# Altium project SpartanMainBoard.PrjPcb
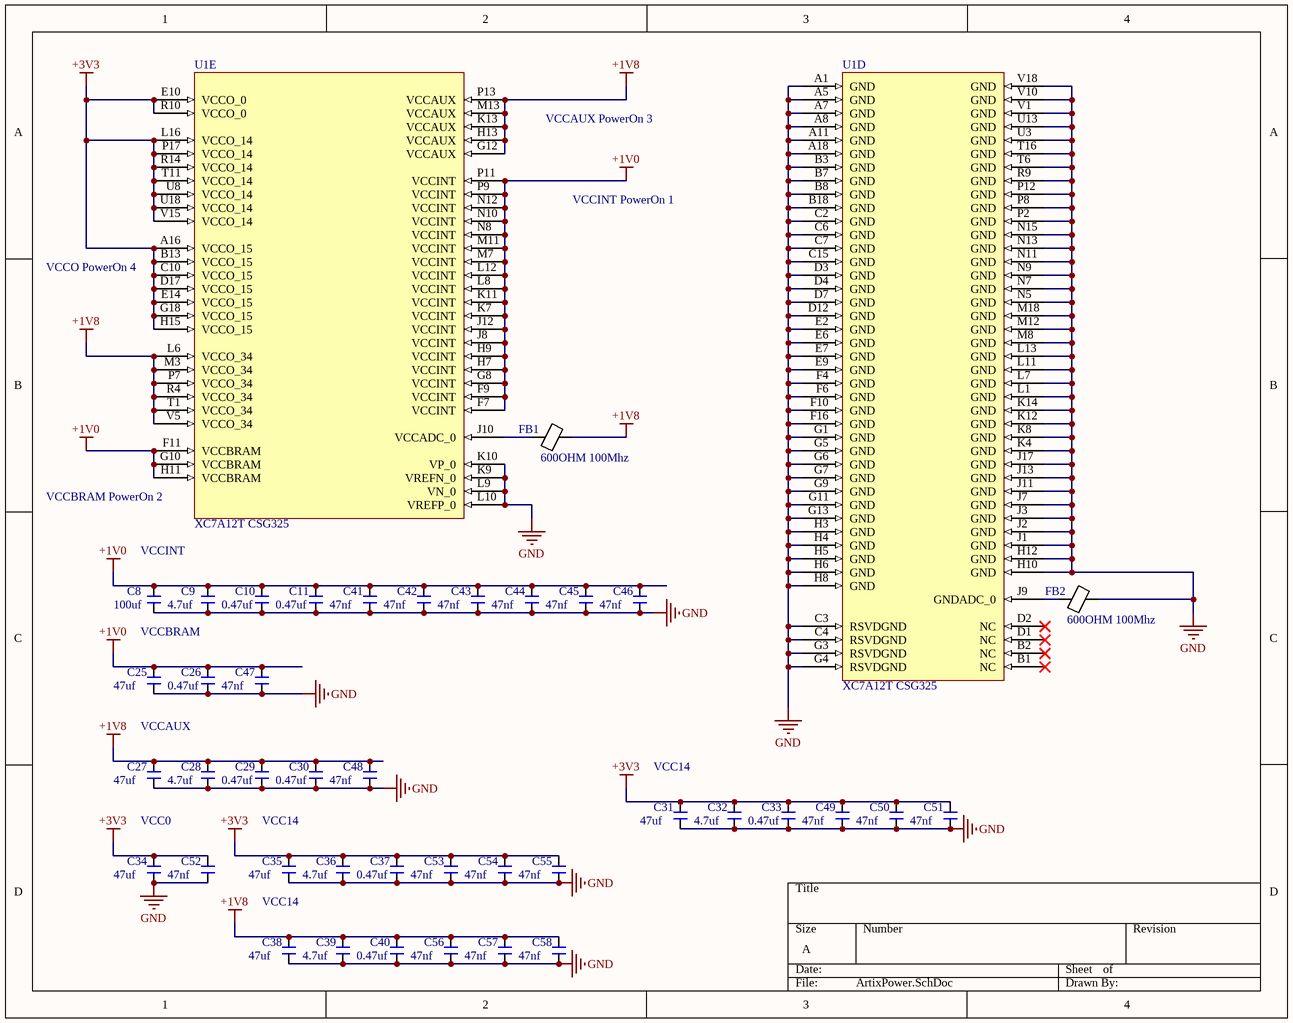
[diagram p0: ArtixPower.SchDoc]
7 sheets, 147 parts. Net scope: global (net labels, ports and power ports of the same name join across sheets).
Board file: PCB1.PcbDoc
Sheets:
  ArtixPower.SchDoc
  ArtixConfig.SchDoc
  ArtixBank14.SchDoc
  ArtixBank15.SchDoc
  ArtixTranscievers.SchDoc
  ArtixBank34.SchDoc
  Power.SchDoc

## Sheet ArtixPower.SchDoc
size A

### Parts
C8  100uf  [1206]
C9  4.7uf  [0402Footprint]
C10  0.47uf  [0402Footprint]
C11  0.47uf  [0402Footprint]
C25  47uf  [0805FOOTPRINT]
C26  0.47uf  [0402Footprint]
C27  47uf  [0805FOOTPRINT]
C28  4.7uf  [0402Footprint]
C29  0.47uf  [0402Footprint]
C30  0.47uf  [0402Footprint]
C31  47uf  [0805FOOTPRINT]
C32  4.7uf  [0402Footprint]
C33  0.47uf  [0402Footprint]
C34  47uf  [0805FOOTPRINT]
C35  47uf  [0805FOOTPRINT]
C36  4.7uf  [0402Footprint]
C37  0.47uf  [0402Footprint]
C38  47uf  [0805FOOTPRINT]
C39  4.7uf  [0402Footprint]
C40  0.47uf  [0402Footprint]
C41  47nf  [0402Footprint]
C42  47nf  [0402Footprint]
C43  47nf  [0402Footprint]
C44  47nf  [0402Footprint]
C45  47nf  [0402Footprint]
C46  47nf  [0402Footprint]
C47  47nf  [0402Footprint]
C48  47nf  [0402Footprint]
C49  47nf  [0402Footprint]
C50  47nf  [0402Footprint]
C51  47nf  [0402Footprint]
C52  47nf  [0402Footprint]
C53  47nf  [0402Footprint]
C54  47nf  [0402Footprint]
C55  47nf  [0402Footprint]
C56  47nf  [0402Footprint]
C57  47nf  [0402Footprint]
C58  47nf  [0402Footprint]
FB1  600OHM 100Mhz  [0805]
FB2  600OHM 100Mhz  [0805]
U1  XC7A12T CSG325  [BGA324C80P18X18_1500X1500X150]  (parts D,E of 7)

### Nets
+1V0: C8.1 C9.1 C10.1 C11.1 C25.1 C26.1 C41.1 C42.1 C43.1 C44.1 C45.1 C46.1 C47.1 U1.F7(VCCINT) U1.F9(VCCINT) U1.F11(VCCBRAM) U1.G8(VCCINT) U1.G10(VCCBRAM) U1.H7(VCCINT) U1.H9(VCCINT) U1.H11(VCCBRAM) U1.J8(VCCINT) U1.J12(VCCINT) U1.K7(VCCINT) U1.K11(VCCINT) U1.L8(VCCINT) U1.L12(VCCINT) U1.M7(VCCINT) U1.M11(VCCINT) U1.N8(VCCINT) U1.N10(VCCINT) U1.N12(VCCINT) U1.P9(VCCINT) U1.P11(VCCINT)
+1V8: C27.1 C28.1 C29.1 C30.1 C38.1 C39.1 C40.1 C48.1 C56.1 C57.1 C58.1 FB1.2 U1.G12(VCCAUX) U1.H13(VCCAUX) U1.K13(VCCAUX) U1.L6(VCCO_34) U1.M3(VCCO_34) U1.M13(VCCAUX) U1.P7(VCCO_34) U1.P13(VCCAUX) U1.R4(VCCO_34) U1.T1(VCCO_34) U1.V5(VCCO_34)
+3V3: C31.1 C32.1 C33.1 C34.1 C35.1 C36.1 C37.1 C49.1 C50.1 C51.1 C52.1 C53.1 C54.1 C55.1 U1.A16(VCCO_15) U1.B13(VCCO_15) U1.C10(VCCO_15) U1.D17(VCCO_15) U1.E10(VCCO_0) U1.E14(VCCO_15) U1.G18(VCCO_15) U1.H15(VCCO_15) U1.L16(VCCO_14) U1.P17(VCCO_14) U1.R10(VCCO_0) U1.R14(VCCO_14) U1.T11(VCCO_14) U1.U8(VCCO_14) U1.U18(VCCO_14) U1.V15(VCCO_14)
GND: C8.2 C9.2 C10.2 C11.2 C25.2 C26.2 C27.2 C28.2 C29.2 C30.2 C31.2 C32.2 C33.2 C34.2 C35.2 C36.2 C37.2 C38.2 C39.2 C40.2 C41.2 C42.2 C43.2 C44.2 C45.2 C46.2 C47.2 C48.2 C49.2 C50.2 C51.2 C52.2 C53.2 C54.2 C55.2 C56.2 C57.2 C58.2 FB2.2 U1.A1(GND) U1.A5(GND) U1.A7(GND) U1.A8(GND) U1.A11(GND) U1.A18(GND) U1.B3(GND) U1.B7(GND) U1.B8(GND) U1.B18(GND) U1.C2(GND) U1.C3(RSVDGND) U1.C4(RSVDGND) U1.C6(GND) U1.C7(GND) U1.C15(GND) U1.D3(GND) U1.D4(GND) U1.D7(GND) U1.D12(GND) U1.E2(GND) U1.E6(GND) U1.E7(GND) U1.E9(GND) U1.F4(GND) U1.F6(GND) U1.F10(GND) U1.F16(GND) U1.G1(GND) U1.G3(RSVDGND) U1.G4(RSVDGND) U1.G5(GND) U1.G6(GND) U1.G7(GND) U1.G9(GND) U1.G11(GND) U1.G13(GND) U1.H3(GND) U1.H4(GND) U1.H5(GND) U1.H6(GND) U1.H8(GND) U1.H10(GND) U1.H12(GND) U1.J1(GND) U1.J2(GND) U1.J3(GND) U1.J7(GND) U1.J11(GND) U1.J13(GND) U1.J17(GND) U1.K4(GND) U1.K8(GND) U1.K9(VREFN_0) U1.K10(VP_0) U1.K12(GND) U1.K14(GND) U1.L1(GND) U1.L7(GND) U1.L9(VN_0) U1.L10(VREFP_0) U1.L11(GND) U1.L13(GND) U1.M8(GND) U1.M12(GND) U1.M18(GND) U1.N5(GND) U1.N7(GND) U1.N9(GND) U1.N11(GND) U1.N13(GND) U1.N15(GND) U1.P2(GND) U1.P8(GND) U1.P12(GND) U1.R9(GND) U1.T6(GND) U1.T16(GND) U1.U3(GND) U1.U13(GND) U1.V1(GND) U1.V10(GND) U1.V18(GND)
NetFB1_1: FB1.1 U1.J10(VCCADC_0)
NetFB2_1: FB2.1 U1.J9(GNDADC_0)

Not connected (* = marked no-connect by the designer): U1 B1(NC)* B2(NC)* D1(NC)* D2(NC)*

### Notes on the sheet
- VCCAUX PowerOn 3
- VCCINT PowerOn 1
- VCCO PowerOn 4
- (near U1) VCCBRAM PowerOn 2
- VCCINT
- VCCBRAM
- VCCAUX
- (near C31) VCC14
- VCC0
- VCC14

### Library data of the parts
C8 = 100uf_1206: 1206; Manufacturer 1: *; Manufacturer Part Number 1: *
C9 C28 C32 C36 C39 = 4.7uf_0402: 0402; Manufacturer 1: *; Manufacturer Part Number 1: *
C10 C11 C26 C29 C30 C33 C37 C40 = 0.47uf_0402: 0402; Manufacturer 1: *; Manufacturer Part Number 1: *
C25 C27 C31 C34 C35 C38 = 47uf_0805: 0805; Manufacturer 1: *; Manufacturer Part Number 1: *
C41-C58 = 47nf_0402: 0402; Manufacturer 1: *; Manufacturer Part Number 1: *
FB1 FB2 = HZ0805E601R-10: FERRITE BEAD 600 OHM 0805; Manufacturer 1: Laird-Signal Integrity; Manufacturer Part Number 1: HZ0805E601R-10
U1 = XC7A12T_1CSG325I

## Sheet ArtixConfig.SchDoc
size A
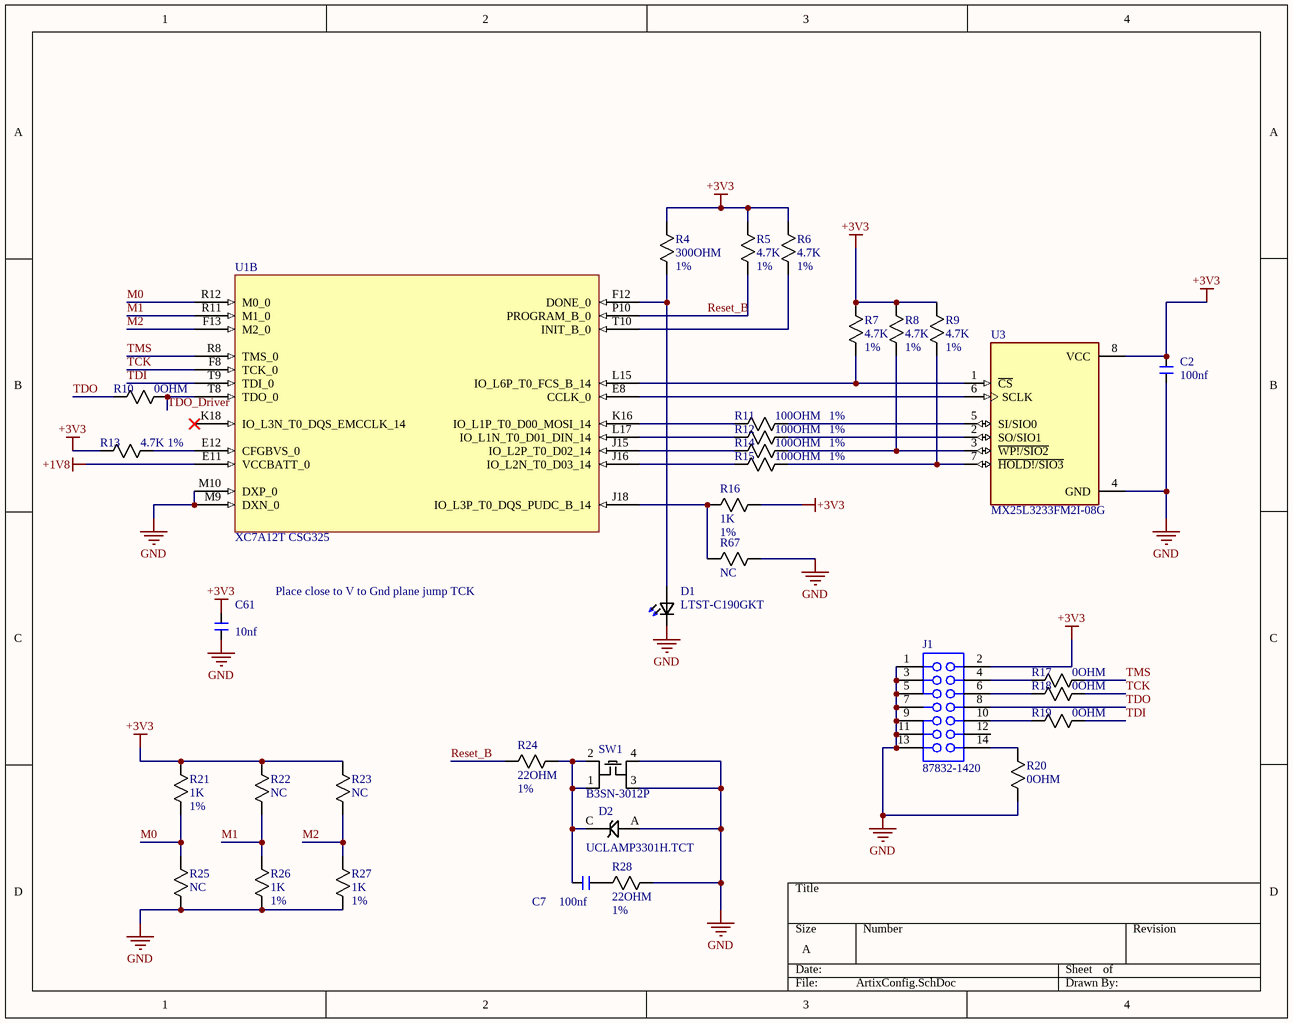
[diagram p1: ArtixConfig.SchDoc]

### Parts
C2  100nf  [0402Footprint]
C7  100nf  [0402Footprint]
C61  10nf  [0402Footprint]
D1  LTST-C190GKT  [0603]
D2  UCLAMP3301H.TCT  [SODFL160X70-2L]
J1  87832-1420  [MOLEX_87832-1420]
R4  300OHM  Tolerance: 1%  [RES_CRCW_0402]
R5  4.7K  Tolerance: 1%  [RES_CRCW_0402]
R6  4.7K  Tolerance: 1%  [RES_CRCW_0402]
R7  4.7K  Tolerance: 1%  [RES_CRCW_0402]
R8  4.7K  Tolerance: 1%  [RES_CRCW_0402]
R9  4.7K  Tolerance: 1%  [RES_CRCW_0402]
R10  0OHM  [RES_CRCW_0402]
R11  100OHM  Tolerance: 1%  [RES_CRCW_0402]
R12  100OHM  Tolerance: 1%  [RES_CRCW_0402]
R13  4.7K  Tolerance: 1%  [RES_CRCW_0402]
R14  100OHM  Tolerance: 1%  [RES_CRCW_0402]
R15  100OHM  Tolerance: 1%  [RES_CRCW_0402]
R16  1K  Tolerance: 1%  [RES_CRCW_0402]
R17  0OHM  [RES_CRCW_0402]
R18  0OHM  [RES_CRCW_0402]
R19  0OHM  [RES_CRCW_0402]
R20  0OHM  [RES_CRCW_0402]
R21  1K  Tolerance: 1%  [RES_CRCW_0402]
R22  NC  [RES_CRCW_0402]
R23  NC  [RES_CRCW_0402]
R24  22OHM  Tolerance: 1%  [RES_CRCW_0402]
R25  NC  [RES_CRCW_0402]
R26  1K  Tolerance: 1%  [RES_CRCW_0402]
R27  1K  Tolerance: 1%  [RES_CRCW_0402]
R28  22OHM  Tolerance: 1%  [RES_CRCW_0402]
R67  NC  [RES_CRCW_0402]
SW1  B3SN-3012P  [B3SN-3012P]
U1  XC7A12T CSG325  [BGA324C80P18X18_1500X1500X150]  (part B of 7)
U3  MX25L3233FM2I-08G  [SOIC127P790X216-8N_MX25L3233FM2I-08G]

### Nets
+1V8: U1.E11(VCCBATT_0)
+3V3: C2.1 C61.1 J1.2 R4.1 R5.1 R6.1 R7.1 R8.1 R9.1 R13.2 R16.1 R21.1 R22.1 R23.1 U3.8(VCC)
GND: C2.2 C61.2 D1.1(K2) D2.A J1.1 J1.3 J1.5 J1.7 J1.9 J1.11 J1.13 R20.1 R25.2 R26.2 R27.2 R28.1 R67.2 SW1.3 SW1.4 U1.M9(DXN_0) U1.M10(DXP_0) U3.4(GND)
M0: R21.2 R25.1 U1.R12(M0_0)
M1: R22.2 R26.1 U1.R11(M1_0)
M2: R23.2 R27.1 U1.F13(M2_0)
Reset_B: R5.2 R24.2 U1.P10(PROGRAM_B_0)
TCK: R18.1 U1.F8(TCK_0)
TDI: R19.1 U1.T9(TDI_0)
TDO: J1.8 R10.2
TDO_Driver: R10.1 U1.T8(TDO_0)
TMS: R17.1 U1.R8(TMS_0)
NetC7_1: C7.1 R28.2
NetC7_2: C7.2 D2.C R24.1 SW1.1 SW1.2
NetD1_2: D1.2(A2) R4.2 U1.F12(DONE_0)
NetJ1_4: J1.4 R17.2
NetJ1_6: J1.6 R18.2
NetJ1_10: J1.10 R19.2
NetJ1_14: J1.14 R20.2
NetR6_2: R6.2 U1.T10(INIT_B_0)
NetR7_2: R7.2 U1.L15(IO_L6P_T0_FCS_B_14) U3.1(~{CS})
NetR8_2: R8.2 R14.1 U3.3(~{WP!/SIO2})
NetR9_2: R9.2 R15.1 U3.7(~{HOLD!/SIO3})
NetR11_1: R11.1 U3.5(SI/SIO0)
NetR11_2: R11.2 U1.K16(IO_L1P_T0_D00_MOSI_14)
NetR12_1: R12.1 U3.2(SO/SIO1)
NetR12_2: R12.2 U1.L17(IO_L1N_T0_D01_DIN_14)
NetR13_1: R13.1 U1.E12(CFGBVS_0)
NetR14_2: R14.2 U1.J15(IO_L2P_T0_D02_14)
NetR15_2: R15.2 U1.J16(IO_L2N_T0_D03_14)
NetR16_2: R16.2 R67.1 U1.J18(IO_L3P_T0_DQS_PUDC_B_14)
NetU1_E8: U1.E8(CCLK_0) U3.6(SCLK)

Not connected (* = marked no-connect by the designer): J1 12; U1 K18(IO_L3N_T0_DQS_EMCCLK_14)*

### Notes on the sheet
- Place close to V to Gnd plane jump TCK

### Library data of the parts
C2 C7 = 100nf_0402: 0402; Manufacturer 1: *; Manufacturer Part Number 1: *
C61 = 10nf_0402: 0402; Manufacturer 1: *; Manufacturer Part Number 1: *
D1 = LTST-C190GKT: Green 569nm LED Indication - Discrete 2.1V 10mA 0603; Manufacturer: Lite-On Inc.; Availability: Unavailable; Package: 0603 Lite-On; Manufacturer Part Number 1: LTST-C190GKT
D2 = UCLAMP3301H.TCT: TVS Diode 3.3V 8V SOD523
J1 = 87832-1420: Connector Header Surface Mount 14 position 0.079 _2.00mm_; MF: Molex; MP: 87832-1420; Value: *; SnapEDA_Link: https://www.snapeda.com/parts/87832-1420/Molex/view-part/78740/?ref=snap; Price: None; Package: None; Availability: Unavailable
R4 = 300OHM_0402: 0402; Power: 1/10W; Manufacturer 1: *; Manufacturer Part Number 1: *
R5-R9 R13 = 4.7K_0402: 0402; Manufacturer 1: *; Manufacturer Part Number 1: *
R10 R17-R20 = 0OHM_0402: 0402; Manufacturer 1: *; Manufacturer Part Number 1: *
R11 R12 R14 R15 = 100OHM_0402: 0402; Manufacturer 1: *; Manufacturer Part Number 1: *
R16 R21 R26 R27 = 1k_0402: 0402; Manufacturer 1: *; Manufacturer Part Number 1: *
R22 R23 R25 R67 = NC_0402: Manufacturer 1: *; Manufacturer Part Number 1: *
R24 R28 = 22OHM_0402: 0402; Manufacturer 1: *; Manufacturer Part Number 1: *
SW1 = B3SN-3012P: Manufacturer: Omron; Mechanical Life: 100000Cycles; Contact Current Rating: 50mA; Operating Force: 1.57N; Voltage Rating (DC): 24V; Throw Configuration: SPST; Contact Resistance: 100mR; Illumination Type: Non-Illuminated,Illuminated; Number of Poles: 1; Electrical Life: 50000Cycles; Switch Travel: 0.25mm; Switch Function: Off-Mom; IP Rating: IP67,Waterproof,Dust Tight; Supplier 1: Digi-Key; Manufacturer Part Number: B3SN-3012P; Stock 1: 48000; Pricing 1: 3000=0.52365 (USD); Mount: Surface Mount; Case/Package: SMD/SMT; Weight: 0.007055oz; Contact Material: Gold; Contact Plating: Gold; Min Operating Temperature: -25°C; Max Operating Temperature: 70°C; Packaging: Tape and Reel; Max Voltage Rating (DC): 24V; Package Quantity: 1; Max Current Rating: 50mA; Current Rating: 50mA; Termination: SMD/SMT; Orientation: Straight; Length: 6.5mm; Height: 3.1mm; Depth: 7mm; Radiation Hardening: No; REACH SVHC: Unknown; Lead Free: Contains Lead; ComponentLink1URL: https://datasheet.ciiva.com/1532/en-b3sn-1532676.pdf; ComponentLink1Description: https://datasheet.ciiva.com/1532/en-b3sn-1532676.pdf; ComponentLink2URL: https://datasheet.ciiva.com/16154/en-b3sn-16154998.pdf; ComponentLink2Description: https://datasheet.ciiva.com/16154/en-b3sn-16154998.pdf; ComponentLink3URL: https://datasheet.ciiva.com/2900/b3sn-1110-2900023.pdf; ComponentLink3Description: https://datasheet.ciiva.com/2900/b3sn-1110-2900023.pdf; ComponentLink4URL: https://datasheet.ciiva.com/5283/en-b3sn-371257-5283623.pdf; ComponentLink4Description: https://datasheet.ciiva.com/5283/en-b3sn-371257-5283623.pdf; ComponentLink5URL: https://datasheet.ciiva.com/2900/b3sn-1110-2900024.pdf; ComponentLink5Description: https://datasheet.ciiva.com/2900/b3sn-1110-2900024.pdf; ComponentLink6URL: https://datasheet.ciiva.com/2900/b3sn-1110-2900025.pdf; ComponentLink6Description: https://datasheet.ciiva.com/2900/b3sn-1110-2900025.pdf; ComponentLink7URL: https://datasheet.ciiva.com/15183/getdatasheetpartid-87284-15183738.pdf; ComponentLink7Description: https://datasheet.ciiva.com/15183/getdatasheetpartid-87284-15183738.pdf; ComponentLink8URL: https://datasheet.ciiva.com/30076/en-b3sn-30076973.pdf; ComponentLink8Description: https://datasheet.ciiva.com/30076/en-b3sn-30076973.pdf; Supplier Part Number 1: SW261TR-ND
U1 = XC7A12T_1CSG325I
U3 = MX25L3233FM2I-08G: FLASH - NOR Memory IC 32Mb _8M x 4_ SPI - Quad I/O 133MHz 8-SOP; MF: Macronix; SnapEDA_Link: https://www.snapeda.com/parts/MX25L3233FM2I-08G/Macronix/view-part/2101968/?ref=snap; Price: None; MP: MX25L3233FM2I-08G; Package: SOIC-8 Macronix; Value: *; Availability: Unavailable

## Sheet ArtixBank14.SchDoc
size A
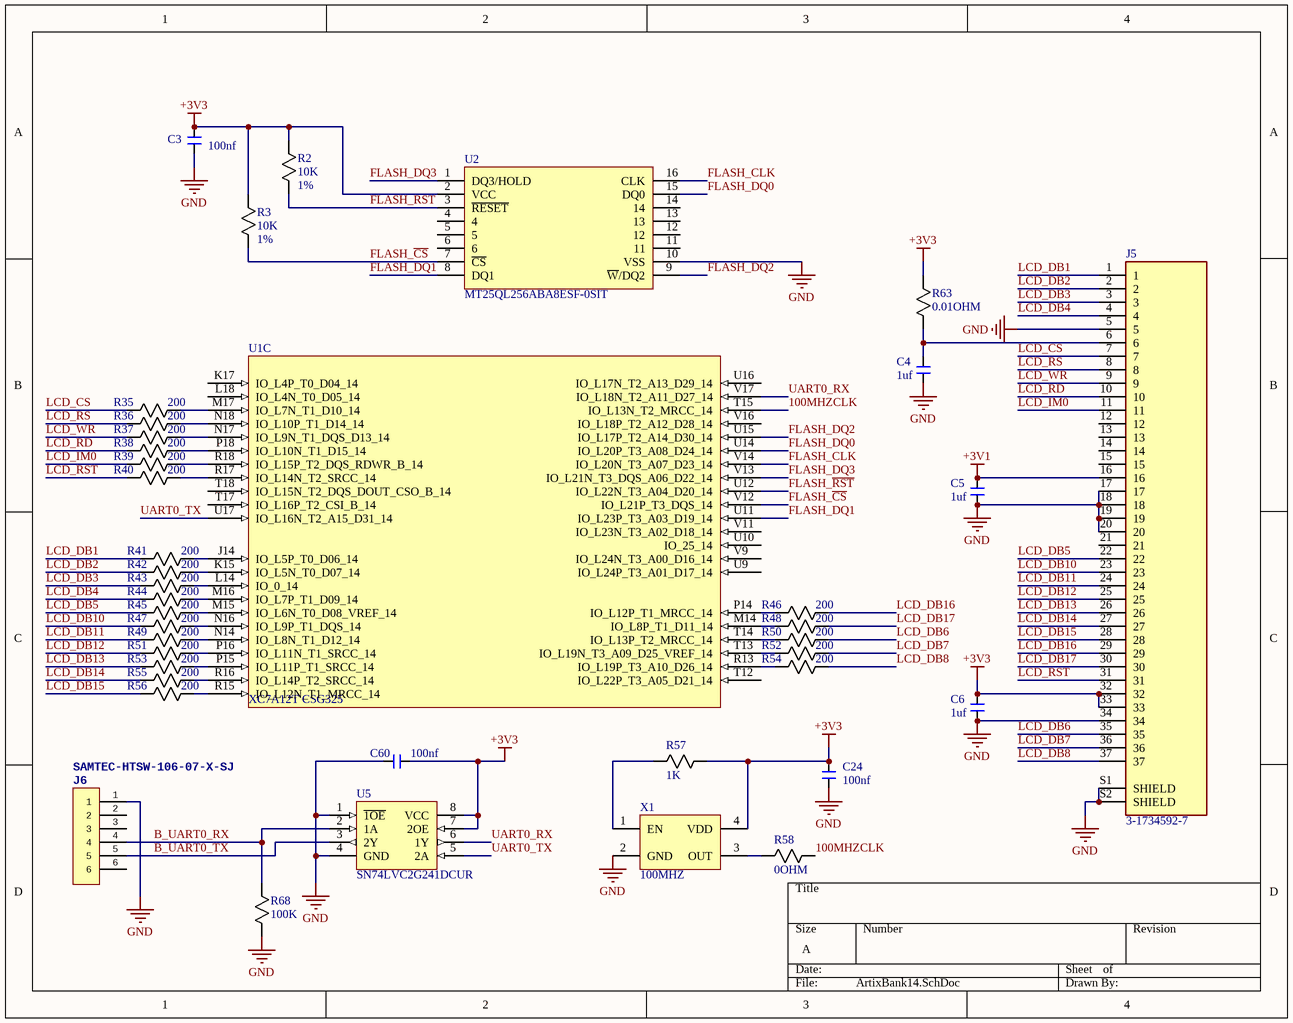
[diagram p2: ArtixBank14.SchDoc]

### Parts
C3  100nf  [0402Footprint]
C4  1uf  [0402Footprint]
C5  1uf  [0402Footprint]
C6  1uf  [0402Footprint]
C24  100nf  [0402Footprint]
C60  100nf  [0402Footprint]
J5  3-1734592-7  [TE_3-1734592-7]
J6  SAMTEC-HTSW-106-07-X-SJ  [SAMTEC-HTSW-106-07-X-S]
R2  10K  Tolerance: 1%  [RES_CRCW_0402]
R3  10K  Tolerance: 1%  [RES_CRCW_0402]
R35  200  [RES_CRCW_0402]
R36  200  [RES_CRCW_0402]
R37  200  [RES_CRCW_0402]
R38  200  [RES_CRCW_0402]
R39  200  [RES_CRCW_0402]
R40  200  [RES_CRCW_0402]
R41  200  [RES_CRCW_0402]
R42  200  [RES_CRCW_0402]
R43  200  [RES_CRCW_0402]
R44  200  [RES_CRCW_0402]
R45  200  [RES_CRCW_0402]
R46  200  [RES_CRCW_0402]
R47  200  [RES_CRCW_0402]
R48  200  [RES_CRCW_0402]
R49  200  [RES_CRCW_0402]
R50  200  [RES_CRCW_0402]
R51  200  [RES_CRCW_0402]
R52  200  [RES_CRCW_0402]
R53  200  [RES_CRCW_0402]
R54  200  [RES_CRCW_0402]
R55  200  [RES_CRCW_0402]
R56  200  [RES_CRCW_0402]
R57  1K  [RES_CRCW_0402]
R58  0OHM  [RES_CRCW_0402]
R63  0.01OHM  [RESC1508X06N]
R68  100K  [RES_CRCW_0402]
U1  XC7A12T CSG325  [BGA324C80P18X18_1500X1500X150]  (part C of 7)
U2  MT25QL256ABA8ESF-0SIT  [SOP127P1030X265-16N]
U5  SN74LVC2G241DCUR  [SOP50P310X90-8N]
X1  100MHZ  [SIT8008AI-12-33E-100.000000E]

### Nets
+3V1: C5.1 J5.16
+3V3: C3.1 C6.1 C24.1 C60.1 J5.32 J5.33 R2.1 R3.1 R57.1 R63.1 U2.2(VCC) U5.7(2OE) U5.8(VCC) X1.4(VDD)
GND: C3.2 C4.2 C5.2 C6.2 C24.2 C60.2 J5.5 J5.17 J5.18 J5.19 J5.20 J5.34 J5.S1(SHIELD) J5.S2(SHIELD) J6.1 R68.2 U2.10(VSS) U5.1(~{1OE}) U5.4(GND) X1.2(GND)
100MHZCLK: R58.1 U1.T15(IO_L13N_T2_MRCC_14)
B_UART0_RX: J6.4 R68.1 U5.2(1A)
B_UART0_TX: J6.5 U5.3(2Y)
FLASH_~{CS}: R3.2 U1.V12(IO_L21P_T3_DQS_14) U2.7(~{CS})
FLASH_CLK: U1.V14(IO_L20N_T3_A07_D23_14) U2.16(CLK)
FLASH_DQ0: U1.U14(IO_L20P_T3_A08_D24_14) U2.15(DQ0)
FLASH_DQ1: U1.U11(IO_L23P_T3_A03_D19_14) U2.8(DQ1)
FLASH_DQ2: U1.U15(IO_L17P_T2_A14_D30_14) U2.9(~{W}/DQ2)
FLASH_DQ3: U1.V13(IO_L21N_T3_DQS_A06_D22_14) U2.1(DQ3/HOLD)
FLASH_~{RST}: R2.2 U1.U12(IO_L22N_T3_A04_D20_14) U2.3(~{RESET})
LCD_CS: J5.7 R35.2
LCD_DB1: J5.1 R41.2
LCD_DB2: J5.2 R42.2
LCD_DB3: J5.3 R43.2
LCD_DB4: J5.4 R44.2
LCD_DB5: J5.22 R45.2
LCD_DB6: J5.35 R50.1
LCD_DB7: J5.36 R52.1
LCD_DB8: J5.37 R54.1
LCD_DB10: J5.23 R47.2
LCD_DB11: J5.24 R49.2
LCD_DB12: J5.25 R51.2
LCD_DB13: J5.26 R53.2
LCD_DB14: J5.27 R55.2
LCD_DB15: J5.28 R56.2
LCD_DB16: J5.29 R46.1
LCD_DB17: J5.30 R48.1
LCD_IM0: J5.11 R39.2
LCD_RD: J5.10 R38.2
LCD_RS: J5.8 R36.2
LCD_RST: J5.31 R40.2
LCD_WR: J5.9 R37.2
UART0_RX: U1.V17(IO_L18N_T2_A11_D27_14) U5.6(1Y)
UART0_TX: U1.U17(IO_L16N_T2_A15_D31_14) U5.5(2A)
NetC4_1: C4.1 J5.6 R63.2
NetR35_1: R35.1 U1.M17(IO_L7N_T1_D10_14)
NetR36_1: R36.1 U1.N18(IO_L10P_T1_D14_14)
NetR37_1: R37.1 U1.N17(IO_L9N_T1_DQS_D13_14)
NetR38_1: R38.1 U1.P18(IO_L10N_T1_D15_14)
NetR39_1: R39.1 U1.R18(IO_L15P_T2_DQS_RDWR_B_14)
NetR40_1: R40.1 U1.R17(IO_L14N_T2_SRCC_14)
NetR41_1: R41.1 U1.J14(IO_L5P_T0_D06_14)
NetR42_1: R42.1 U1.K15(IO_L5N_T0_D07_14)
NetR43_1: R43.1 U1.L14(IO_0_14)
NetR44_1: R44.1 U1.M16(IO_L7P_T1_D09_14)
NetR45_1: R45.1 U1.M15(IO_L6N_T0_D08_VREF_14)
NetR46_2: R46.2 U1.P14(IO_L12P_T1_MRCC_14)
NetR47_1: R47.1 U1.N16(IO_L9P_T1_DQS_14)
NetR48_2: R48.2 U1.M14(IO_L8P_T1_D11_14)
NetR49_1: R49.1 U1.N14(IO_L8N_T1_D12_14)
NetR50_2: R50.2 U1.T14(IO_L13P_T2_MRCC_14)
NetR51_1: R51.1 U1.P16(IO_L11N_T1_SRCC_14)
NetR52_2: R52.2 U1.T13(IO_L19N_T3_A09_D25_VREF_14)
NetR53_1: R53.1 U1.P15(IO_L11P_T1_SRCC_14)
NetR54_2: R54.2 U1.R13(IO_L19P_T3_A10_D26_14)
NetR55_1: R55.1 U1.R16(IO_L14P_T2_SRCC_14)
NetR56_1: R56.1 U1.R15(IO_L12N_T1_MRCC_14)
NetR57_2: R57.2 X1.1(EN)
NetR58_2: R58.2 X1.3(OUT)

Not connected (* = marked no-connect by the designer): J5 12 13 14 15 21; J6 2 3 6; U1 K17(IO_L4P_T0_D04_14) L18(IO_L4N_T0_D05_14) T12(IO_L22P_T3_A05_D21_14) T17(IO_L16P_T2_CSI_B_14) T18(IO_L15N_T2_DQS_DOUT_CSO_B_14) U9(IO_L24P_T3_A01_D17_14) U10(IO_25_14) U16(IO_L17N_T2_A13_D29_14) V9(IO_L24N_T3_A00_D16_14) V11(IO_L23N_T3_A02_D18_14) V16(IO_L18P_T2_A12_D28_14); U2 4 5 6 11 12 13 14

### Library data of the parts
C3 C24 C60 = 100nf_0402: 0402; Manufacturer 1: *; Manufacturer Part Number 1: *
C4-C6 = 1uf_0402: 0402; Manufacturer 1: *; Manufacturer Part Number 1: *
J5 = 3-1734592-7: Conn FPC Connector SKT 37 POS 0.5mm Solder RA SMD T/R; MF: TE Connectivity; SnapEDA_Link: https://www.snapeda.com/parts/3-1734592-7/TE%20Connectivity/view-part/4788466/?ref=snap; Package: None; DigiKey-Purchase-URL: https://snapeda.com/shop?store=DigiKey&id=4788466; Availability: Unavailable; Price: None; MP: 3-1734592-7; Value: *
J6 = SAMTEC-HTSW-106-07-X-SJ: 6 pin 2.54mm pitch header
R2 R3 = 10K_0402: 0402; Manufacturer Part Number 1: CRCW040210K0FKED; Manufacturer 1: *
R35-R56 = 200OHM_0402: 0402; Tolerance: 1%; Manufacturer 1: *; Manufacturer Part Number 1: *
R57 = 1k_0402: 0402; Tolerance: 1%; Manufacturer 1: *; Manufacturer Part Number 1: *
R58 = 0OHM_0402: 0402; Manufacturer 1: *; Manufacturer Part Number 1: *
R63 = 0.01OHM_0603: 0603; Manufacturer 1: *; Manufacturer Part Number 1: *
R68 = 100K_0402: 0402; Tolerance: 1%; Manufacturer 1: *; Manufacturer Part Number 1: *
U1 = XC7A12T_1CSG325I
U2 = MT25QL256ABA8ESF-0SIT: 256 Mb Flash Micron
U5 = SN74LVC2G241DCUR: Buffer, Non-Inverting 2 Element 1 Bit per Element 3-State Output 8-VSSOP; MF: Texas Instruments; Price: None; Value: *; MP: SN74LVC2G241DCUR; Package: VFSOP-8 Texas Instruments; SnapEDA_Link: https://www.snapeda.com/parts/SN74LVC2G241DCUR/Texas%20Instruments/view-part/278306/?ref=snap; Availability: Unavailable
X1 = SIT8008AI-12-33E-100.000000E

## Sheet ArtixBank15.SchDoc
size A
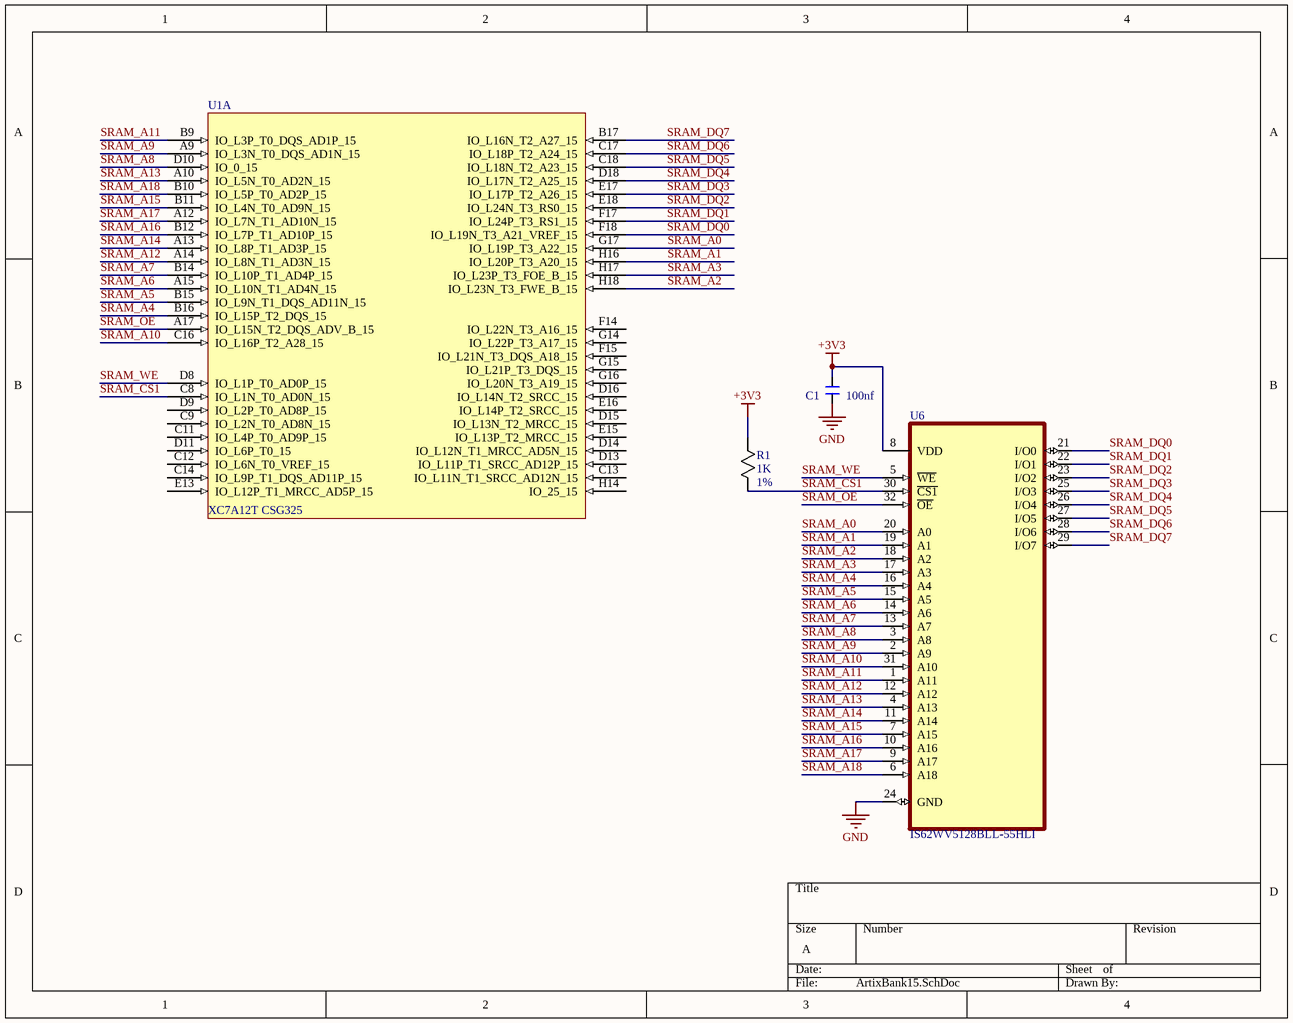
[diagram p3: ArtixBank15.SchDoc]

### Parts
C1  100nf  [0402Footprint]
R1  1K  Tolerance: 1%  [RES_CRCW_0402]
U1  XC7A12T CSG325  [BGA324C80P18X18_1500X1500X150]  (part A of 7)
U6  IS62WV5128BLL-55HLI  [SOIC50P1340X125-32N]

### Nets
+3V3: C1.1 R1.1 U6.8(VDD)
GND: C1.2 U6.24(GND)
SRAM_A0: U1.G17(IO_L19P_T3_A22_15) U6.20(A0)
SRAM_A1: U1.H16(IO_L20P_T3_A20_15) U6.19(A1)
SRAM_A2: U1.H18(IO_L23N_T3_FWE_B_15) U6.18(A2)
SRAM_A3: U1.H17(IO_L23P_T3_FOE_B_15) U6.17(A3)
SRAM_A4: U1.B16(IO_L15P_T2_DQS_15) U6.16(A4)
SRAM_A5: U1.B15(IO_L9N_T1_DQS_AD11N_15) U6.15(A5)
SRAM_A6: U1.A15(IO_L10N_T1_AD4N_15) U6.14(A6)
SRAM_A7: U1.B14(IO_L10P_T1_AD4P_15) U6.13(A7)
SRAM_A8: U1.D10(IO_0_15) U6.3(A8)
SRAM_A9: U1.A9(IO_L3N_T0_DQS_AD1N_15) U6.2(A9)
SRAM_A10: U1.C16(IO_L16P_T2_A28_15) U6.31(A10)
SRAM_A11: U1.B9(IO_L3P_T0_DQS_AD1P_15) U6.1(A11)
SRAM_A12: U1.A14(IO_L8N_T1_AD3N_15) U6.12(A12)
SRAM_A13: U1.A10(IO_L5N_T0_AD2N_15) U6.4(A13)
SRAM_A14: U1.A13(IO_L8P_T1_AD3P_15) U6.11(A14)
SRAM_A15: U1.B11(IO_L4N_T0_AD9N_15) U6.7(A15)
SRAM_A16: U1.B12(IO_L7P_T1_AD10P_15) U6.10(A16)
SRAM_A17: U1.A12(IO_L7N_T1_AD10N_15) U6.9(A17)
SRAM_A18: U1.B10(IO_L5P_T0_AD2P_15) U6.6(A18)
SRAM_~{CS1}: R1.2 U1.C8(IO_L1N_T0_AD0N_15) U6.30(~{CS1})
SRAM_DQ0: U1.F18(IO_L19N_T3_A21_VREF_15) U6.21(I/O0)
SRAM_DQ1: U1.F17(IO_L24P_T3_RS1_15) U6.22(I/O1)
SRAM_DQ2: U1.E18(IO_L24N_T3_RS0_15) U6.23(I/O2)
SRAM_DQ3: U1.E17(IO_L17P_T2_A26_15) U6.25(I/O3)
SRAM_DQ4: U1.D18(IO_L17N_T2_A25_15) U6.26(I/O4)
SRAM_DQ5: U1.C18(IO_L18N_T2_A23_15) U6.27(I/O5)
SRAM_DQ6: U1.C17(IO_L18P_T2_A24_15) U6.28(I/O6)
SRAM_DQ7: U1.B17(IO_L16N_T2_A27_15) U6.29(I/O7)
SRAM_OE: U1.A17(IO_L15N_T2_DQS_ADV_B_15) U6.32(~{OE})
SRAM_WE: U1.D8(IO_L1P_T0_AD0P_15) U6.5(~{WE})

Not connected (* = marked no-connect by the designer): U1 C9(IO_L2N_T0_AD8N_15) C11(IO_L4P_T0_AD9P_15) C12(IO_L6N_T0_VREF_15) C13(IO_L11N_T1_SRCC_AD12N_15) C14(IO_L9P_T1_DQS_AD11P_15) D9(IO_L2P_T0_AD8P_15) D11(IO_L6P_T0_15) D13(IO_L11P_T1_SRCC_AD12P_15) D14(IO_L12N_T1_MRCC_AD5N_15) D15(IO_L13N_T2_MRCC_15) D16(IO_L14N_T2_SRCC_15) E13(IO_L12P_T1_MRCC_AD5P_15) E15(IO_L13P_T2_MRCC_15) E16(IO_L14P_T2_SRCC_15) F14(IO_L22N_T3_A16_15) F15(IO_L21N_T3_DQS_A18_15) G14(IO_L22P_T3_A17_15) G15(IO_L21P_T3_DQS_15) G16(IO_L20N_T3_A19_15) H14(IO_25_15)

### Library data of the parts
C1 = 100nf_0402: 0402; Manufacturer 1: *; Manufacturer Part Number 1: *
R1 = 1k_0402: 0402; Manufacturer 1: *; Manufacturer Part Number 1: *
U1 = XC7A12T_1CSG325I
U6 = IS62WV5128BLL-55HLI: SRAM - Asynchronous Memory IC 4Mb _512K x 8_ Parallel 55ns 32-sTSOP I; MF: ISSI, Integrated; Package: LFSOP-32 ISSI; SnapEDA_Link: https://www.snapeda.com/parts/IS62WV5128BLL-55HLI/ISSI,%20Integrated%20Silicon%20Solution%20Inc/view-part/33690/?ref=snap; Digi-Key_Part_Number: IS62WV5128BLL-55HLI-TR-ND; Value: *; MP: IS62WV5128BLL-55HLI

## Sheet ArtixTranscievers.SchDoc
size A
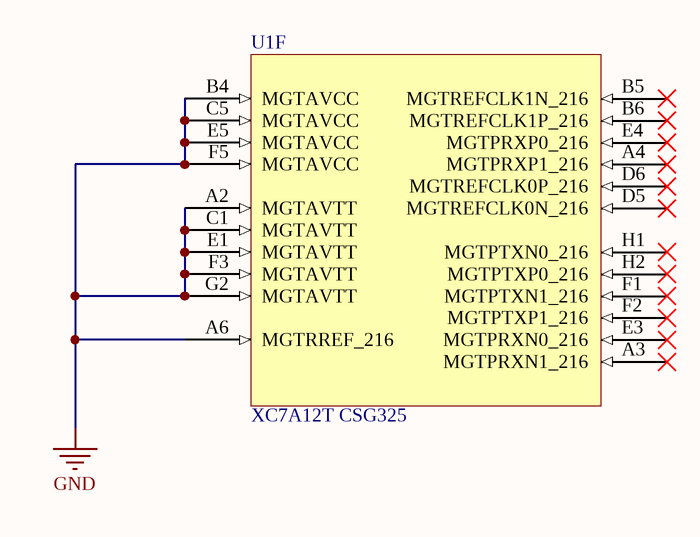
[diagram p4: ArtixTranscievers.SchDoc]

### Parts
U1  XC7A12T CSG325  [BGA324C80P18X18_1500X1500X150]  (part F of 7)

### Nets
GND: U1.A2(MGTAVTT) U1.A6(MGTRREF_216) U1.B4(MGTAVCC) U1.C1(MGTAVTT) U1.C5(MGTAVCC) U1.E1(MGTAVTT) U1.E5(MGTAVCC) U1.F3(MGTAVTT) U1.F5(MGTAVCC) U1.G2(MGTAVTT)

Not connected (* = marked no-connect by the designer): U1 A3(MGTPRXN1_216)* A4(MGTPRXP1_216)* B5(MGTREFCLK1N_216)* B6(MGTREFCLK1P_216)* D5(MGTREFCLK0N_216)* D6(MGTREFCLK0P_216)* E3(MGTPRXN0_216)* E4(MGTPRXP0_216)* F1(MGTPTXN1_216)* F2(MGTPTXP1_216)* H1(MGTPTXN0_216)* H2(MGTPTXP0_216)*

### Library data of the parts
U1 = XC7A12T_1CSG325I

## Sheet ArtixBank34.SchDoc
size A
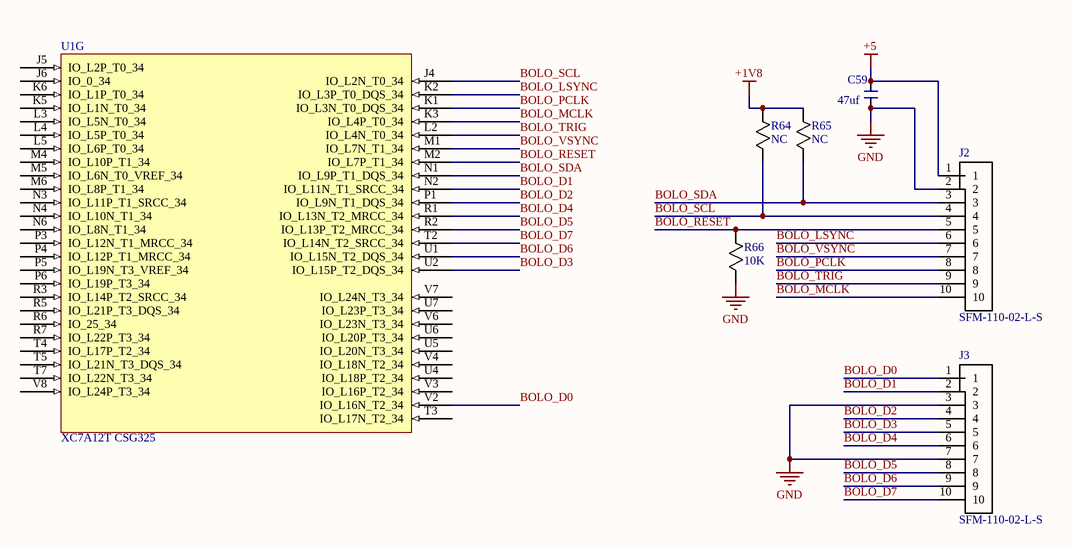
[diagram p5: ArtixBank34.SchDoc]

### Parts
C59  47uf  [0805FOOTPRINT]
J2  SFM-110-02-L-S  [SFM-110-02-L-S]
J3  SFM-110-02-L-S  [SFM-110-02-L-S]
R64  NC  [RES_CRCW_0402]
R65  NC  [RES_CRCW_0402]
R66  10K  [RES_CRCW_0402]
U1  XC7A12T CSG325  [BGA324C80P18X18_1500X1500X150]  (part G of 7)

### Nets
+1V8: R64.1 R65.1
+5: C59.1 J2.1
GND: C59.2 J2.2 J3.3 J3.7 R66.2
BOLO_D0: J3.1 U1.V2(IO_L16N_T2_34)
BOLO_D1: J3.2 U1.N2(IO_L11N_T1_SRCC_34)
BOLO_D2: J3.4 U1.P1(IO_L9N_T1_DQS_34)
BOLO_D3: J3.5 U1.U2(IO_L15P_T2_DQS_34)
BOLO_D4: J3.6 U1.R1(IO_L13N_T2_MRCC_34)
BOLO_D5: J3.8 U1.R2(IO_L13P_T2_MRCC_34)
BOLO_D6: J3.9 U1.U1(IO_L15N_T2_DQS_34)
BOLO_D7: J3.10 U1.T2(IO_L14N_T2_SRCC_34)
BOLO_LSYNC: J2.6 U1.K2(IO_L3P_T0_DQS_34)
BOLO_MCLK: J2.10 U1.K3(IO_L4P_T0_34)
BOLO_PCLK: J2.8 U1.K1(IO_L3N_T0_DQS_34)
BOLO_RESET: J2.5 R66.1 U1.M2(IO_L7P_T1_34)
BOLO_SCL: J2.4 R64.2 U1.J4(IO_L2N_T0_34)
BOLO_SDA: J2.3 R65.2 U1.N1(IO_L9P_T1_DQS_34)
BOLO_TRIG: J2.9 U1.L2(IO_L4N_T0_34)
BOLO_VSYNC: J2.7 U1.M1(IO_L7N_T1_34)

Not connected (* = marked no-connect by the designer): U1 J5(IO_L2P_T0_34) J6(IO_0_34) K5(IO_L1N_T0_34) K6(IO_L1P_T0_34) L3(IO_L5N_T0_34) L4(IO_L5P_T0_34) L5(IO_L6P_T0_34) M4(IO_L10P_T1_34) M5(IO_L6N_T0_VREF_34) M6(IO_L8P_T1_34) N3(IO_L11P_T1_SRCC_34) N4(IO_L10N_T1_34) N6(IO_L8N_T1_34) P3(IO_L12N_T1_MRCC_34) P4(IO_L12P_T1_MRCC_34) P5(IO_L19N_T3_VREF_34) P6(IO_L19P_T3_34) R3(IO_L14P_T2_SRCC_34) R5(IO_L21P_T3_DQS_34) R6(IO_25_34) R7(IO_L22P_T3_34) T3(IO_L17N_T2_34) T4(IO_L17P_T2_34) T5(IO_L21N_T3_DQS_34) T7(IO_L22N_T3_34) U4(IO_L18P_T2_34) U5(IO_L20N_T3_34) U6(IO_L20P_T3_34) U7(IO_L23P_T3_34) V3(IO_L16P_T2_34) V4(IO_L18N_T2_34) V6(IO_L23N_T3_34) V7(IO_L24N_T3_34) V8(IO_L24P_T3_34)

### Library data of the parts
C59 = 47uf_0805: 0805; Manufacturer 1: *; Manufacturer Part Number 1: *
R64 R65 = NC_0402: Manufacturer 1: *; Manufacturer Part Number 1: *
R66 = 10K_0402: 0402; Manufacturer Part Number 1: CRCW040210K0FKED; Tolerance: 1%; Manufacturer 1: *
U1 = XC7A12T_1CSG325I

## Sheet Power.SchDoc
size A
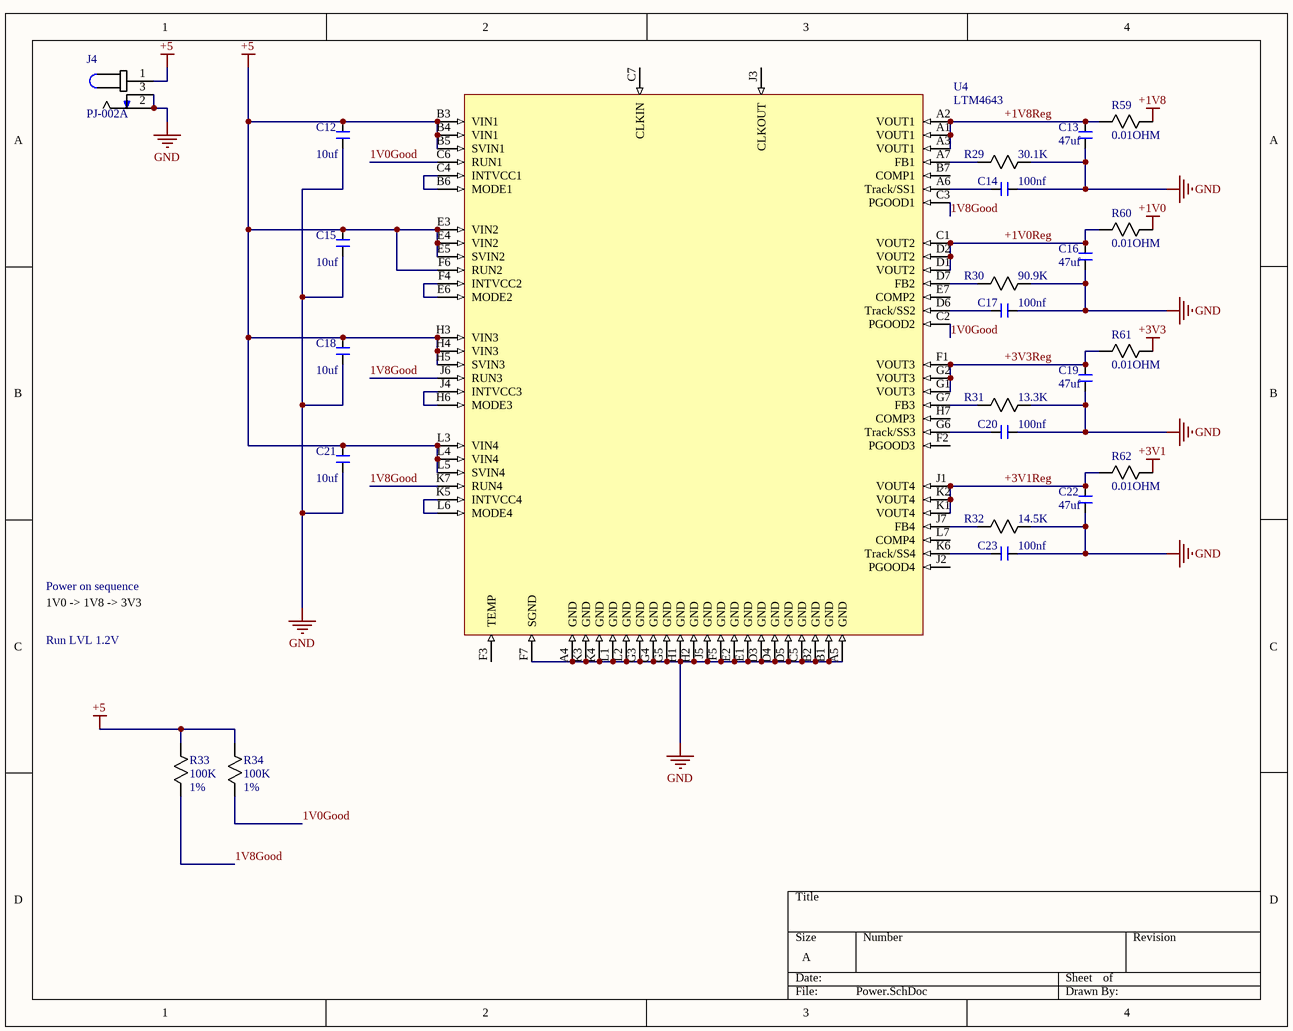
[diagram p6: Power.SchDoc]

### Parts
C12  10uf  [0402Footprint]
C13  47uf  [0805FOOTPRINT]
C14  100nf  [0402Footprint]
C15  10uf  [0402Footprint]
C16  47uf  [0805FOOTPRINT]
C17  100nf  [0402Footprint]
C18  10uf  [0402Footprint]
C19  47uf  [0805FOOTPRINT]
C20  100nf  [0402Footprint]
C21  10uf  [0402Footprint]
C22  47uf  [0805FOOTPRINT]
C23  100nf  [0402Footprint]
J4  PJ-002A  [CUI_PJ-002A]
R29  30.1K  [RES_CRCW_0402]
R30  90.9K  [RES_CRCW_0402]
R31  13.3K  [RES_CRCW_0402]
R32  14.5K  [RES_CRCW_0402]
R33  100K  Tolerance: 1%  [RES_CRCW_0402]
R34  100K  Tolerance: 1%  [RES_CRCW_0402]
R59  0.01OHM  [RESC1508X06N]
R60  0.01OHM  [RESC1508X06N]
R61  0.01OHM  [RESC1508X06N]
R62  0.01OHM  [RESC1508X06N]
U4  LTM4643  [LTM4643 15X9X2.42 05-08-1908]

### Nets
+1V0: R60.1
+1V8: R59.1
+3V1: R62.1
+3V3: R61.1
+5: C12.1 C15.1 C18.1 C21.1 J4.1 R33.1 R34.1 U4.B3(VIN1) U4.B4(VIN1) U4.B5(SVIN1) U4.E3(VIN2) U4.E4(VIN2) U4.E5(SVIN2) U4.F6(RUN2) U4.H3(VIN3) U4.H4(VIN3) U4.H5(SVIN3) U4.L3(VIN4) U4.L4(VIN4) U4.L5(SVIN4)
GND: C12.2 C13.1 C14.1 C15.2 C16.1 C17.1 C18.2 C19.1 C20.1 C21.2 C22.1 C23.1 J4.2 J4.3 R29.1 R30.1 R31.1 R32.1 U4.A4(GND) U4.A5(GND) U4.B1(GND) U4.B2(GND) U4.C5(GND) U4.D3(GND) U4.D4(GND) U4.D5(GND) U4.E1(GND) U4.E2(GND) U4.F5(GND) U4.F7(SGND) U4.G3(GND) U4.G4(GND) U4.G5(GND) U4.H1(GND) U4.H2(GND) U4.J5(GND) U4.K3(GND) U4.K4(GND) U4.L1(GND) U4.L2(GND)
1V0Good: R34.2 U4.C2(PGOOD2) U4.C6(RUN1)
1V8Good: R33.2 U4.C3(PGOOD1) U4.J6(RUN3) U4.K7(RUN4)
+1V0Reg: C16.2 R60.2 U4.C1(VOUT2) U4.D1(VOUT2) U4.D2(VOUT2)
+1V8Reg: C13.2 R59.2 U4.A1(VOUT1) U4.A2(VOUT1) U4.A3(VOUT1)
+3V1Reg: C22.2 R62.2 U4.J1(VOUT4) U4.K1(VOUT4) U4.K2(VOUT4)
+3V3Reg: C19.2 R61.2 U4.F1(VOUT3) U4.G1(VOUT3) U4.G2(VOUT3)
NetC14_2: C14.2 U4.A6(Track/SS1)
NetC17_2: C17.2 U4.D6(Track/SS2)
NetC20_2: C20.2 U4.G6(Track/SS3)
NetC23_2: C23.2 U4.K6(Track/SS4)
NetR29_2: R29.2 U4.A7(FB1)
NetR30_2: R30.2 U4.D7(FB2)
NetR31_2: R31.2 U4.G7(FB3)
NetR32_2: R32.2 U4.J7(FB4)
NetU4_B6: U4.B6(MODE1) U4.C4(INTVCC1)
NetU4_E6: U4.E6(MODE2) U4.F4(INTVCC2)
NetU4_H6: U4.H6(MODE3) U4.J4(INTVCC3)
NetU4_K5: U4.K5(INTVCC4) U4.L6(MODE4)

Not connected (* = marked no-connect by the designer): U4 B7(COMP1) C7(CLKIN) E7(COMP2) F2(PGOOD3) F3(TEMP) H7(COMP3) J2(PGOOD4) J3(CLKOUT) L7(COMP4)

### Notes on the sheet
- Power on sequence
- 1V0 -> 1V8 -> 3V3
- Run LVL 1.2V

### Library data of the parts
C12 C15 C18 C21 = 10uf_0402: 0402; Manufacturer 1: *; Manufacturer Part Number 1: *
C13 C16 C19 C22 = 47uf_0805: 0805; Manufacturer 1: *; Manufacturer Part Number 1: *
C14 C17 C20 C23 = 100nf_0402: 0402; Manufacturer 1: *; Manufacturer Part Number 1: *
J4 = PJ-002A: 2.0 mm Center Pin, 2.5 A, Right Angle, Through Hole, Dc Power Jack Connector; MF: CUI Inc.; MP: PJ-002A; Digi-Key_Part_Number: CP-002A-ND; SnapEDA_Link: https://www.snapeda.com/parts/PJ-002A/CUI%20Inc./view-part/?ref=snap; Package: None; Digi-Key_Purchase_URL: https://www.digikey.com/product-detail/en/cui-inc/PJ-002A/CP-002A-ND/96962?utm_source=snapeda&utm_medium=aggregator&utm_campaign=symbol; CUI_purchase_URL: https://www.cui.com/product/interconnect/dc-power-connectors/jacks/2.0-mm-center-pin/pj-002a?utm_source=snapeda.com&utm_medium=referral&utm_campaign=snapedaBOM; Value: *
R29 = 30.1K_0402: 0402; Tolerance: 1%; Manufacturer 1: *; Manufacturer Part Number 1: *
R30 = 90.9K_0402: 0402; Tolerance: 1%; Manufacturer 1: *; Manufacturer Part Number 1: *
R31 = 13.3K_0402: 0402; Tolerance: 1%; Manufacturer 1: *; Manufacturer Part Number 1: *
R32 = 14.5K_0402: 0402; Tolerance: 1%; Manufacturer 1: *; Manufacturer Part Number 1: *
R33 R34 = 100K_0402: 0402; Manufacturer 1: *; Manufacturer Part Number 1: *
R59-R62 = 0.01OHM_0603: 0603; Manufacturer 1: *; Manufacturer Part Number 1: *

## Nets that join several sheets
+1V0: ArtixPower (34 pins), Power (R60.1)
+1V8: ArtixPower (23 pins), ArtixConfig (U1.E11), ArtixBank34 (R64.1 R65.1), Power (R59.1)
+3V1: ArtixBank14 (C5.1 J5.16), Power (R62.1)
+3V3: ArtixPower (30 pins), ArtixConfig (15 pins), ArtixBank14 (14 pins), ArtixBank15 (C1.1 R1.1 U6.8), Power (R61.1)
+5: ArtixBank34 (C59.1 J2.1), Power (20 pins)
GND: ArtixPower (122 pins), ArtixConfig (22 pins), ArtixBank14 (20 pins), ArtixBank15 (C1.2 U6.24), ArtixTranscievers (10 pins), ArtixBank34 (5 pins), Power (40 pins)

## Assembly variants
QuadFlashBoot: not fitted R22 R23 R25 R64 R65 R67